# EAGLE design baseboard_rev_0.2 (EAGLE 6.4)
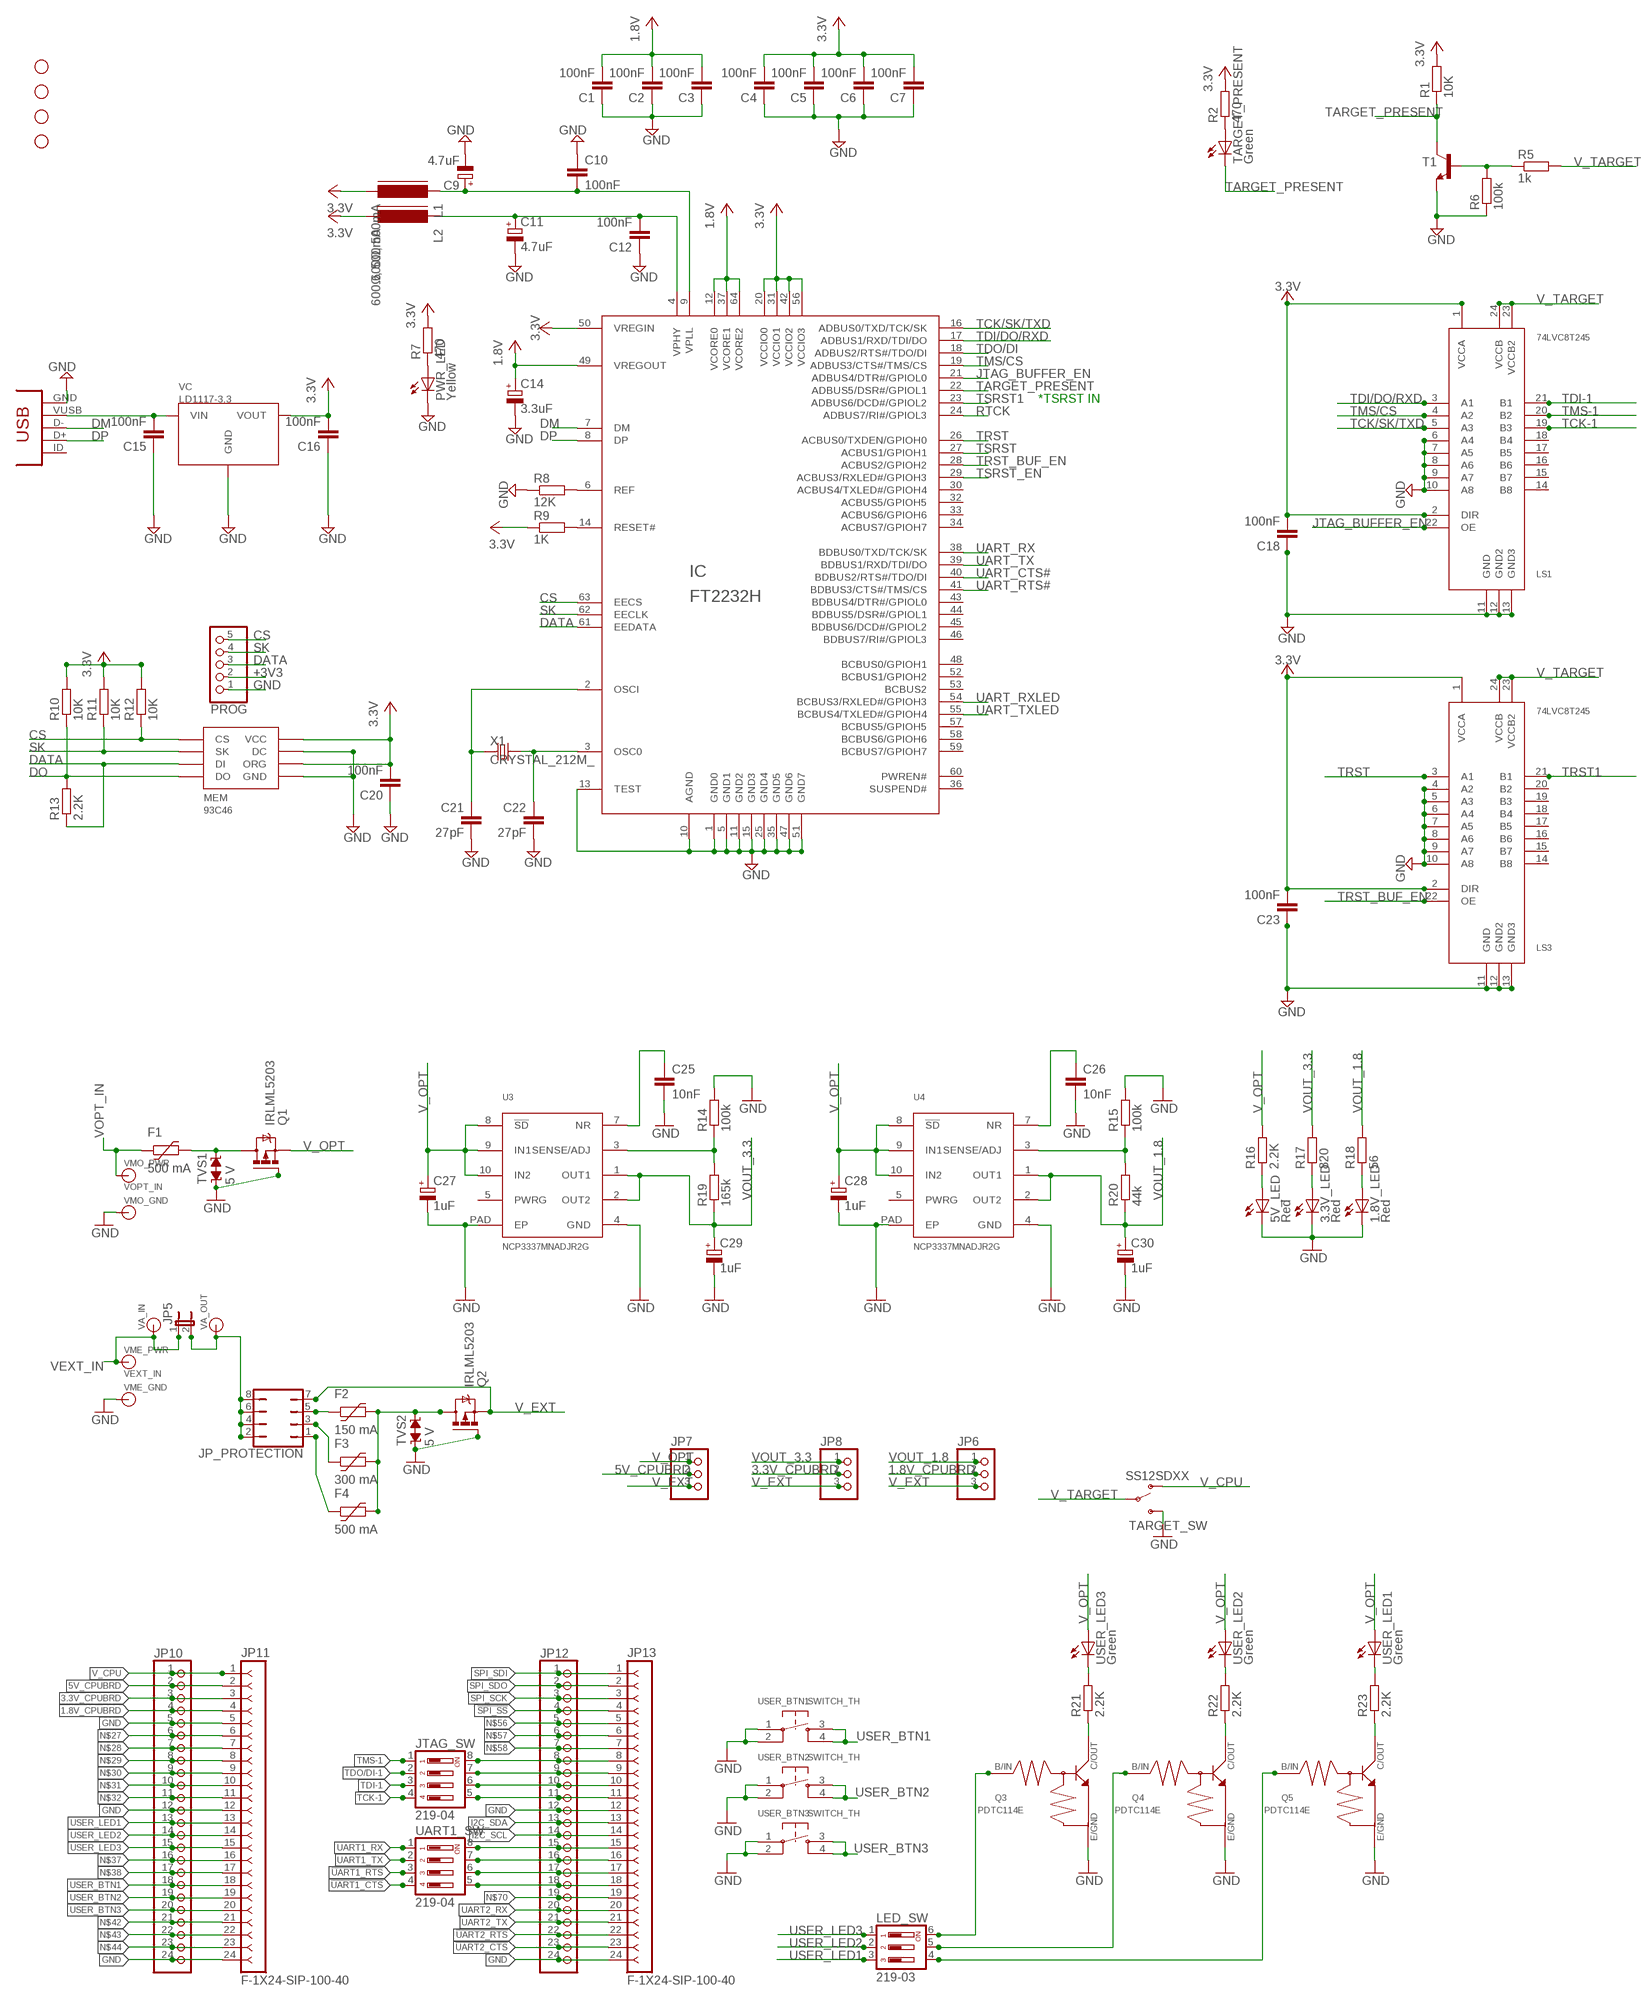
[diagram p0: schematic, sheet 1, part 1 of 2]
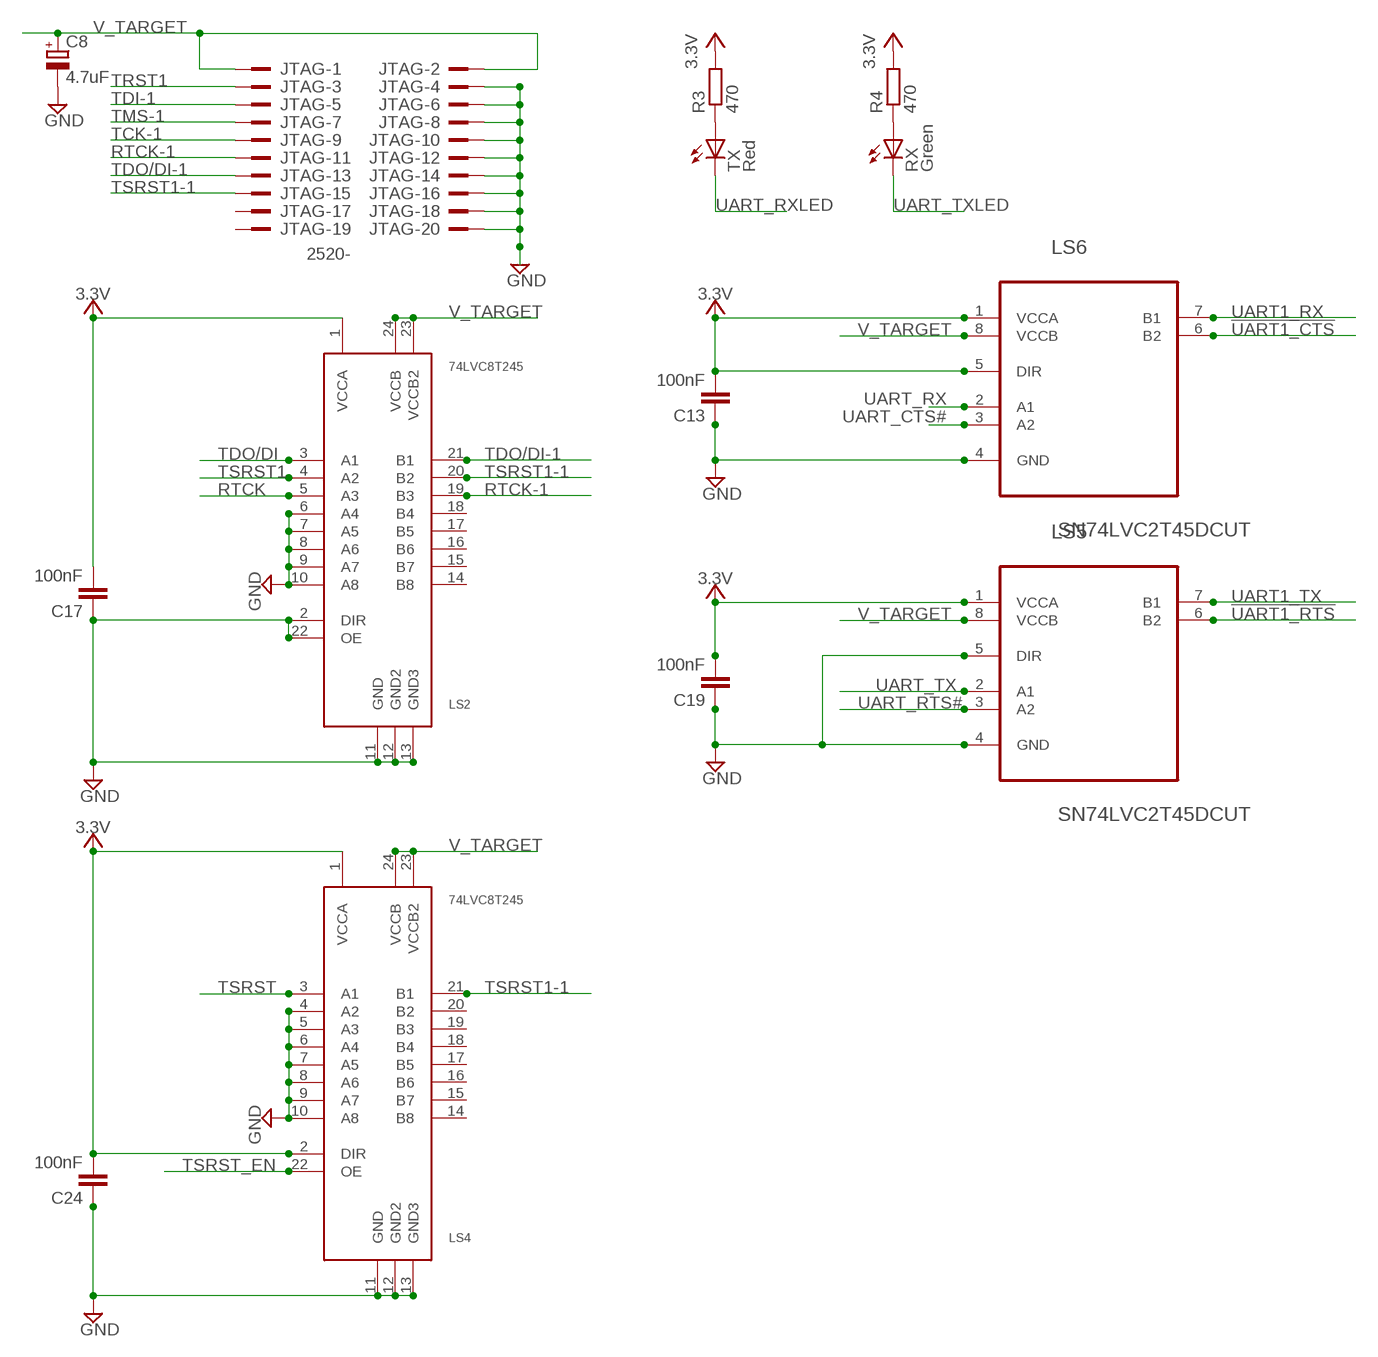
[diagram p1: schematic, sheet 1, part 2 of 2]

## Parts
1.8V_LED  Red  LEDCHIPLED_0805  [CHIPLED_0805]
3.3V_LED  Red  LEDCHIPLED_0805  [CHIPLED_0805]
5V_LED  Red  LEDCHIPLED_0805  [CHIPLED_0805]
C1  100nF  CAPC805  [C805]
C2  100nF  CAPC805  [C805]
C3  100nF  CAPC805  [C805]
C4  100nF  CAPC805  [C805]
C5  100nF  CAPC805  [C805]
C6  100nF  CAPC805  [C805]
C7  100nF  CAPC805  [C805]
C8  4.7uF  CAP_POLSMC_A  [SMC_A]
C9  4.7uF  CAP_POLSMC_A  [SMC_A]
C10  100nF  CAPC805  [C805]
C11  4.7uF  CAP_POLSMC_A  [SMC_A]
C12  100nF  CAPC805  [C805]
C13  100nF  CAPC805  [C805]
C14  3.3uF  CAP_POLSMC_A  [SMC_A]
C15  100nF  CAPC805  [C805]
C16  100nF  CAPC805  [C805]
C17  100nF  CAPC805  [C805]
C18  100nF  CAPC805  [C805]
C19  100nF  CAPC805  [C805]
C20  100nF  CAPC805  [C805]
C21  27pF  CAPC805  [C805]
C22  27pF  CAPC805  [C805]
C23  100nF  CAPC805  [C805]
C24  100nF  CAPC805  [C805]
C25  10nF  C-EUC0805  [C0805]
C26  10nF  C-EUC0805  [C0805]
C27  1uF  CPOL-EUB  [PANASONIC_B]
C28  1uF  CPOL-EUB  [PANASONIC_B]
C29  1uF  CPOL-EUB  [PANASONIC_B]
C30  1uF  CPOL-EUB  [PANASONIC_B]
CONN1  CONN_USB  [CONN_USB_MINI-B]
F1  500 mA  1206L  [1206L]
F2  150 mA  1206L  [1206L]
F3  300 mA  1206L  [1206L]
F4  500 mA  1206L  [1206L]
IC  FT2232H  [LQFP64]
JP1  STAND-OFF  [STAND-OFF]
JP2  STAND-OFF  [STAND-OFF]
JP3  STAND-OFF  [STAND-OFF]
JP4  STAND-OFF  [STAND-OFF]
JP5  JUMPER-2PTH  [1X02]
JP6  PINHD-1X3  [1X03]
JP7  PINHD-1X3  [1X03]
JP8  PINHD-1X3  [1X03]
JP10  PINHD-1X24  [1X24]
JP11  F-1X24-SIP-100-40  [SIP-100-24-40]
JP12  PINHD-1X24  [1X24]
JP13  F-1X24-SIP-100-40  [SIP-100-24-40]
JP_PROTECTION  JP4Q  [JP4Q]
JTAG  2520-  [PAK100/2500-20]
JTAG_SW  219-04  [CTS-219-04]
L1  600Ω, 500mA  FERRITE_BEAD805  [FB805]
L2  600Ω, 500mA  FERRITE_BEAD805  [FB805]
LED_SW  219-03  [CTS-219-03]
LS1  74LVC8T245  [TSSOP24]
LS2  74LVC8T245  [TSSOP24]
LS3  74LVC8T245  [TSSOP24]
LS4  74LVC8T245  [TSSOP24]
LS5  SN74LVC2T45DCUT  [SOP50P310X90-8N]
LS6  SN74LVC2T45DCUT  [SOP50P310X90-8N]
MEM  93C46  [SOIC8]
PROG  PINHD-1X5  [1X05]
PWR_LED  Yellow  LEDCHIPLED_0805  [CHIPLED_0805]
Q1  IRLML5203  [MICRO3]
Q2  IRLML5203  [MICRO3]
Q3  PDTC114E  [SOT416]
Q4  PDTC114E  [SOT416]
Q5  PDTC114E  [SOT416]
R1  10K  RESISTORR805R805  [R805]
R2  470  RESISTORR805R805  [R805]
R3  470  RESISTORR805R805  [R805]
R4  470  RESISTORR805R805  [R805]
R5  1k  RESISTORR805R805  [R805]
R6  100k  RESISTORR805R805  [R805]
R7  470  RESISTORR805R805  [R805]
R8  12K  RESISTORR805R805  [R805]
R9  1K  RESISTORR805R805  [R805]
R10  10K  RESISTORR805R805  [R805]
R11  10K  RESISTORR805R805  [R805]
R12  10K  RESISTORR805R805  [R805]
R13  2.2K  RESISTORR805R805  [R805]
R14  100k  R-EU_R0805  [R0805]
R15  100k  R-EU_R0805  [R0805]
R16  2.2K  R-EU_R0805  [R0805]
R17  820  R-EU_R0805  [R0805]
R18  56  R-EU_R0805  [R0805]
R19  165k  R-EU_R0805  [R0805]
R20  44k  R-EU_R0805  [R0805]
R21  2.2K  R-EU_R0805  [R0805]
R22  2.2K  R-EU_R0805  [R0805]
R23  2.2K  R-EU_R0805  [R0805]
RX  Green  LEDCHIPLED_0805  [CHIPLED_0805]
T1  NPNSOT23BEC  [SOT23-BEC]
TARGET_PRESENT  Green  LEDCHIPLED_0805  [CHIPLED_0805]
TARGET_SW  SS12SDXX  [SS12SDXX]
TVS1  5 V  TVS-0805  [TVS0805]
TVS2  5 V  TVS-0805  [TVS0805]
TX  Red  LEDCHIPLED_0805  [CHIPLED_0805]
U3  NCP3337MNADJR2G  NCP3337  [DFN10]
U4  NCP3337MNADJR2G  NCP3337  [DFN10]
UART1_SW  219-04  [CTS-219-04]
USER_BTN1  SWITCH_TH  [SWITCH_TROUGHHOLE]
USER_BTN2  SWITCH_TH  [SWITCH_TROUGHHOLE]
USER_BTN3  SWITCH_TH  [SWITCH_TROUGHHOLE]
USER_LED1  Green  LEDCHIPLED_0805  [CHIPLED_0805]
USER_LED2  Green  LEDCHIPLED_0805  [CHIPLED_0805]
USER_LED3  Green  LEDCHIPLED_0805  [CHIPLED_0805]
VA_IN  BANANA_CONN  [BANANA_CONN]
VA_OUT  BANANA_CONN  [BANANA_CONN]
VC  LD1117-3.3  [SOT223]
VME_GND  BANANA_CONN  [BANANA_CONN]
VME_PWR  VEXT_IN  BANANA_CONN  [BANANA_CONN]
VMO_GND  BANANA_CONN  [BANANA_CONN]
VMO_PWR  VOPT_IN  BANANA_CONN  [BANANA_CONN]
X1  CRYSTAL_212M_  [4X6]

## Nets
1.8V: C1.2 C2.2 C3.2 C14.+ IC.12(VCORE0) IC.37(VCORE1) IC.49(VREGOUT) IC.64(VCORE2)
1.8V_CPUBRD: JP6.2 JP10.4 JP11.4
3.3V_CPUBRD: JP8.2 JP10.3 JP11.3
5V_CPUBRD: JP7.2 JP10.2 JP11.2
!SPI_SS: JP12.4 JP13.4
!UART1_CTS: LS6.6(B2) UART1_SW.4
!UART1_RTS: LS5.6(B2) UART1_SW.3
!UART2_CTS: JP12.23 JP13.23
!UART2_RTS: JP12.22 JP13.22
+3V3: C4.2 C5.2 C6.2 C7.2 C13.2 C16.2 C17.2 C18.2 C19.2 C20.2 C23.2 C24.2 IC.20(VCCIO0) IC.31(VCCIO1) IC.42(VCCIO2) IC.50(VREGIN) IC.56(VCCIO3) L1.2 L2.2 LS1.1(VCCA) LS1.2(DIR) LS2.1(VCCA) LS3.1(VCCA) LS3.2(DIR) LS4.1(VCCA) LS4.2(DIR) LS5.1(VCCA) LS6.1(VCCA) LS6.5(DIR) MEM.6(ORG) MEM.8(VCC) PROG.2 R1.2 R2.2 R3.2 R4.2 R7.2 R9.1 R10.2 R11.2 R12.2 VC.2(VOUT) ; supply symbol labelled 3.3V
CS: IC.63(EECS) MEM.1(CS) PROG.5 R12.1
DATA: IC.61(EEDATA) MEM.3(DI) PROG.3 R13.1
DM: CONN1.D- IC.7(DM)
DO: MEM.4(DO) R10.1 R13.2
DP: CONN1.D+ IC.8(DP)
GND: 1.8V_LED.C 3.3V_LED.C 5V_LED.C C1.1 C2.1 C3.1 C4.1 C5.1 C6.1 C7.1 C8.- C9.- C10.1 C11.- C12.1 C13.1 C14.- C15.1 C16.1 C17.1 C18.1 C19.1 C20.1 C21.2 C22.2 C23.1 C24.1 C25.2 C26.2 C27.- C28.- C29.- C30.- CONN1.GND IC.1(GND0) IC.5(GND1) IC.10(AGND) IC.11(GND2) IC.13(TEST) IC.15(GND3) IC.25(GND4) IC.35(GND5) IC.47(GND6) IC.51(GND7) JP10.5 JP10.12 JP10.24 JP11.5 JP11.12 JP11.24 JP12.12 JP12.24 JP13.12 JP13.24 JTAG.4 JTAG.6 JTAG.8 JTAG.10 JTAG.12 JTAG.14 JTAG.16 JTAG.18 JTAG.20 LS1.6(A4) LS1.7(A5) LS1.8(A6) LS1.9(A7) LS1.10(A8) LS1.11(GND) LS1.12(GND2) LS1.13(GND3) LS2.2(DIR) LS2.6(A4) LS2.7(A5) LS2.8(A6) LS2.9(A7) LS2.10(A8) LS2.11(GND) LS2.12(GND2) LS2.13(GND3) LS2.22(OE) LS3.4(A2) LS3.5(A3) LS3.6(A4) LS3.7(A5) LS3.8(A6) LS3.9(A7) LS3.10(A8) LS3.11(GND) LS3.12(GND2) LS3.13(GND3) LS4.4(A2) LS4.5(A3) LS4.6(A4) LS4.7(A5) LS4.8(A6) LS4.9(A7) LS4.10(A8) LS4.11(GND) LS4.12(GND2) LS4.13(GND3) LS5.4(GND) LS5.5(DIR) LS6.4(GND) MEM.5(GND) MEM.7(DC) PROG.1 PWR_LED.C Q1.1(G) Q2.1(G) Q3.2(E) Q4.2(E) Q5.2(E) R6.1 R8.1 R14.2 R15.2 T1.E TARGET_SW.3 TVS1.1 TVS2.1 U3.4(GND) U3.PAD(EP) U4.4(GND) U4.PAD(EP) USER_BTN1.1 USER_BTN1.2 USER_BTN2.1 USER_BTN2.2 USER_BTN3.1 USER_BTN3.2 VC.1(GND) VME_GND.P$1 VMO_GND.P$1
I2C_SCL: JP12.14 JP13.14
I2C_SDA: JP12.13 JP13.13
JTAG_BUFFER_EN: IC.21(ADBUS4/DTR#/GPIOL0) LS1.22(OE)
JTAG_TCK: JP12.11 JP13.11 JTAG_SW.5
JTAG_TDI: JP12.10 JP13.10 JTAG_SW.6
JTAG_TDO: JP12.9 JP13.9 JTAG_SW.7
JTAG_TMS: JP12.8 JP13.8 JTAG_SW.8
N$1: LED_SW.6 Q3.1(B)
N$2: C22.1 IC.3(OSC0) X1.2(X2)
N$3: F2.P$1 JP_PROTECTION.5
N$4: F3.P$1 JP_PROTECTION.3
N$5: F4.P$1 JP_PROTECTION.1
N$6: F2.P$2 F3.P$2 F4.P$2 Q2.3(D) TVS2.2
N$7: C21.1 IC.2(OSCI) X1.1(X1)
N$8: C15.2 CONN1.VUSB VC.3(VIN)
N$9: IC.14(RESET#) R9.2
N$10: IC.6(REF) R8.2
N$11: 3.3V_LED.A R17.1
N$12: R5.1 R6.2 T1.B
N$13: PWR_LED.A R7.1
N$14: R2.1 TARGET_PRESENT.A
N$15: F1.P$2 Q1.3(D) TVS1.2
N$16: 5V_LED.A R16.1
N$17: R4.1 RX.A
N$18: R3.1 TX.A
N$20: LED_SW.4 Q5.1(B)
N$24: 1.8V_LED.A R18.1
N$27: JP10.6 JP11.6
N$28: JP10.7 JP11.7
N$29: JP10.8 JP11.8
N$30: JP10.9 JP11.9
N$31: JP10.10 JP11.10
N$32: JP10.11 JP11.11
N$37: JP10.16 JP11.16
N$38: JP10.17 JP11.17
N$42: JP10.21 JP11.21
N$43: JP10.22 JP11.22
N$44: JP10.23 JP11.23
N$51: C25.1 U3.7(NR)
N$56: JP12.5 JP13.5
N$57: JP12.6 JP13.6
N$58: JP12.7 JP13.7
N$59: Q3.3(C) R21.1
N$60: R21.2 USER_LED3.C
N$61: R22.2 USER_LED2.C
N$62: R23.2 USER_LED1.C
N$63: Q4.3(C) R22.1
N$66: JP12.15 JP13.15 UART1_SW.8
N$67: JP12.16 JP13.16 UART1_SW.7
N$68: JP12.17 JP13.17 UART1_SW.6
N$69: JP12.18 JP13.18 UART1_SW.5
N$70: JP12.19 JP13.19
N$73: R14.1 R19.2 U3.3(SENSE/ADJ)
N$74: Q5.3(C) R23.1
N$78: C26.1 U4.7(NR)
N$79: LED_SW.5 Q4.1(B)
N$80: R15.1 R20.2 U4.3(SENSE/ADJ)
RTCK: IC.24(ADBUS7/RI#/GPIOL3) LS2.5(A3)
RTCK-1: JTAG.11 LS2.19(B3)
SK: IC.62(EECLK) MEM.2(SK) PROG.4 R11.1
SPI_SCK: JP12.3 JP13.3
SPI_SDI: JP12.1 JP13.1
SPI_SDO: JP12.2 JP13.2
TARGET_PRESENT: IC.22(ADBUS5/DSR#/GPIOL1) R1.1 T1.C TARGET_PRESENT.C
TCK-1: JTAG.9 JTAG_SW.4 LS1.19(B3)
TCK/SK/TXD: IC.16(ADBUS0/TXD/TCK/SK) LS1.5(A3)
TDI-1: JTAG.5 JTAG_SW.3 LS1.21(B1)
TDI/DO/RXD: IC.17(ADBUS1/RXD/TDI/DO) LS1.3(A1)
TDO/DI: IC.18(ADBUS2/RTS#/TDO/DI) LS2.3(A1)
TDO/DI-1: JTAG.13 JTAG_SW.2 LS2.21(B1)
TMS-1: JTAG.7 JTAG_SW.1 LS1.20(B2)
TMS/CS: IC.19(ADBUS3/CTS#/TMS/CS) LS1.4(A2)
TRST: IC.26(ACBUS0/TXDEN/GPIOH0) LS3.3(A1)
TRST1: JTAG.3 LS3.21(B1)
TRST_BUF_EN: IC.28(ACBUS2/GPIOH2) LS3.22(OE)
TSRST: IC.27(ACBUS1/GPIOH1) LS4.3(A1)
TSRST1: IC.23(ADBUS6/DCD#/GPIOL2) LS2.4(A2)
TSRST1-1: JTAG.15 LS2.20(B2) LS4.21(B1)
TSRST_EN: IC.29(ACBUS3/RXLED#/GPIOH3) LS4.22(OE)
UART1_RX: LS6.7(B1) UART1_SW.1
UART1_TX: LS5.7(B1) UART1_SW.2
UART2_RX: JP12.20 JP13.20
UART2_TX: JP12.21 JP13.21
UART_CTS#: IC.40(BDBUS2/RTS#/TDO/DI) LS6.3(A2)
UART_RTS#: IC.41(BDBUS3/CTS#/TMS/CS) LS5.3(A2)
UART_RX: IC.38(BDBUS0/TXD/TCK/SK) LS6.2(A1)
UART_RXLED: IC.54(BCBUS3/RXLED#/GPIOH3) TX.C
UART_TX: IC.39(BDBUS1/RXD/TDI/DO) LS5.2(A1)
UART_TXLED: IC.55(BCBUS4/TXLED#/GPIOH4) RX.C
USER_BTN1: JP10.18 JP11.18 USER_BTN1.3 USER_BTN1.4
USER_BTN2: JP10.19 JP11.19 USER_BTN2.3 USER_BTN2.4
USER_BTN3: JP10.20 JP11.20 USER_BTN3.3 USER_BTN3.4
USER_LED1: JP10.13 JP11.13 LED_SW.3
USER_LED2: JP10.14 JP11.14 LED_SW.2
USER_LED3: JP10.15 JP11.15 LED_SW.1
V_CPU: JP10.1 JP11.1 TARGET_SW.1
V_EXT: JP6.3 JP7.3 JP8.3 JP_PROTECTION.7 Q2.2(S)
V_OPT: C27.+ C28.+ JP7.1 Q1.2(S) R16.2 U3.8(!SD) U3.9(IN1) U3.10(IN2) U4.8(!SD) U4.9(IN1) U4.10(IN2) USER_LED1.A USER_LED2.A USER_LED3.A
V_TARGET: C8.+ JTAG.1 JTAG.2 LS1.23(VCCB2) LS1.24(VCCB) LS2.23(VCCB2) LS2.24(VCCB) LS3.23(VCCB2) LS3.24(VCCB) LS4.23(VCCB2) LS4.24(VCCB) LS5.8(VCCB) LS6.8(VCCB) R5.2 TARGET_SW.2
VEXT_IN: JP5.1 JP5.2 JP_PROTECTION.2 JP_PROTECTION.4 JP_PROTECTION.6 JP_PROTECTION.8 VA_IN.P$1 VA_OUT.P$1 VME_PWR.P$1
VOPT_IN: F1.P$1 VMO_PWR.P$1
VOUT_1.8: C30.+ JP6.1 R18.2 R20.1 U4.1(OUT1) U4.2(OUT2)
VOUT_3.3: C29.+ JP8.1 R17.2 R19.1 U3.1(OUT1) U3.2(OUT2)
VPHY: C11.+ C12.2 IC.4(VPHY) L2.1
VPLL: C9.+ C10.2 IC.9(VPLL) L1.1
Unconnected: CONN1.BODY@1(BODY) CONN1.BODY@2(BODY) CONN1.BODY@3(BODY) CONN1.BODY@4(BODY) CONN1.ID(USBID) IC.30(ACBUS4/TXLED#/GPIOH4) IC.32(ACBUS5/GPIOH5) IC.33(ACBUS6/GPIOH6) IC.34(ACBUS7/GPIOH7) IC.36(SUSPEND#) IC.43(BDBUS4/DTR#/GPIOL0) IC.44(BDBUS5/DSR#/GPIOL1) IC.45(BDBUS6/DCD#/GPIOL2) IC.46(BDBUS7/RI#/GPIOL3) IC.48(BCBUS0/GPIOH1) IC.52(BCBUS1/GPIOH2) IC.53(BCBUS2) IC.57(BCBUS5/GPIOH5) IC.58(BCBUS6/GPIOH6) IC.59(BCBUS7/GPIOH7) IC.60(PWREN#) JTAG.17 JTAG.19 LS1.14(B8) LS1.15(B7) LS1.16(B6) LS1.17(B5) LS1.18(B4) LS2.14(B8) LS2.15(B7) LS2.16(B6) LS2.17(B5) LS2.18(B4) LS3.14(B8) LS3.15(B7) LS3.16(B6) LS3.17(B5) LS3.18(B4) LS3.19(B3) LS3.20(B2) LS4.14(B8) LS4.15(B7) LS4.16(B6) LS4.17(B5) LS4.18(B4) LS4.19(B3) LS4.20(B2) U3.5(PWRG) U4.5(PWRG)

## Notes on the sheet
- *TSRST IN

## Library data of the parts
1.8V_LED 3.3V_LED 5V_LED USER_LED1-USER_LED3 = adafruit:LED: LED
C1-C7 C10 C12 C13 C15-C24 = DP-EagleLibrary:CAP
C8 C9 C11 C14 = DP-EagleLibrary:CAP_POL
C25 C26 = rcl:C-EU: CAPACITOR, European symbol
C27-C30 = rcl:CPOL-EU: POLARIZED CAPACITOR, European symbol
CONN1 = dp_devices:CONN_USB: USB connector
F1-F4 = ptc-littlefuse:1206L
IC = DP-EagleLibrary:FT2232H: DUAL HIGH SPEED USB TO MULTIPURPOSE UART/FIFO IC
JP1-JP4 = SparkFun-Electromechanical:STAND-OFF: #4 Stand Off This is the mechanical footprint for a #4 phillips button head screw. Use the keepout ring to avoid running the screw head into surrounding components. SKU : PRT-00447
JP5 = SparkFun-Passives:JUMPER-2: Jumper Basic 0.1" spaced jumper. Use with breakaway headers.
JP6-JP8 = pinhead:PINHD-1X3: PIN HEADER
JP10 JP12 = pinhead:PINHD-1X24: PIN HEADER
JP11 JP13 = con-headers-jp:F-1X24-: FEMALE HEADER
JP_PROTECTION = jumper:JP4Q: JUMPER
JTAG = con-3m:2520-: 3M (TM) Pak 100 4-Wall Header Source: 3M
JTAG_SW UART1_SW = switch-dil:219-04*: Surface Mount DIP Switch Series 219 SMT CTS Electronic Components Sourc: www.ctscorp.com; OC_FARNELL: unknown; OC_NEWARK: unknown
L1 L2 = DP-EagleLibrary:FERRITE_BEAD
LED_SW = switch-dil:219-03*: Surface Mount DIP Switch Series 219 SMT CTS Electronic Components Sourc: www.ctscorp.com; OC_FARNELL: unknown; OC_NEWARK: unknown
LS1-LS4 = 74lvc8t245:74LVC8T245
LS5 LS6 = 74lvc2t45:SN74LVC2T45DCUT: DUAL-BIT DUAL-SUPPLY BUS TRANSCEIVER WITH CONFIGURABLE VOLTAGE TRANSLATION AND 3-STATE OUTPUTS; MPN: SN74LVC2T45DCUT; OC_FARNELL: 9592768; OC_NEWARK: 01J0800; PACKAGE: SOP-8; SUPPLIER: Texas Instruments
MEM = DP-EagleLibrary:93C46
PROG = pinhead:PINHD-1X5: PIN HEADER
PWR_LED RX TARGET_PRESENT TX = led:LED: LED
Q1 Q2 = transistor-power:IRLML5203: HEXFET P-Channel Power MOSFET
Q3-Q5 = funkfinger:PDTC114E: NXP PDTC114E series http://www.nxp.com/documents/data_sheet/PDTC114E_SER.pdf
R1-R13 = DP-EagleLibrary:RESISTOR
R14-R23 = rcl:R-EU_: RESISTOR, European symbol
T1 = dp_devices:NPN: Most commonly used is SOT23-BEC
TARGET_SW = devboard:SS12SDXX
TVS1 TVS2 = supressor:TVS-: TVS BI-DIRECTIONAL
U3 U4 = devboard:NCP3337
USER_BTN1-USER_BTN3 = funkfinger:SWITCH_TH
VA_IN VA_OUT VME_GND VME_PWR VMO_GND VMO_PWR = SparkFun-Connectors:BANANA_CONN: Through-hole banana jack
VC = DP-EagleLibrary:LD1117-3.3
X1 = dp_devices:CRYSTAL_2

## Board
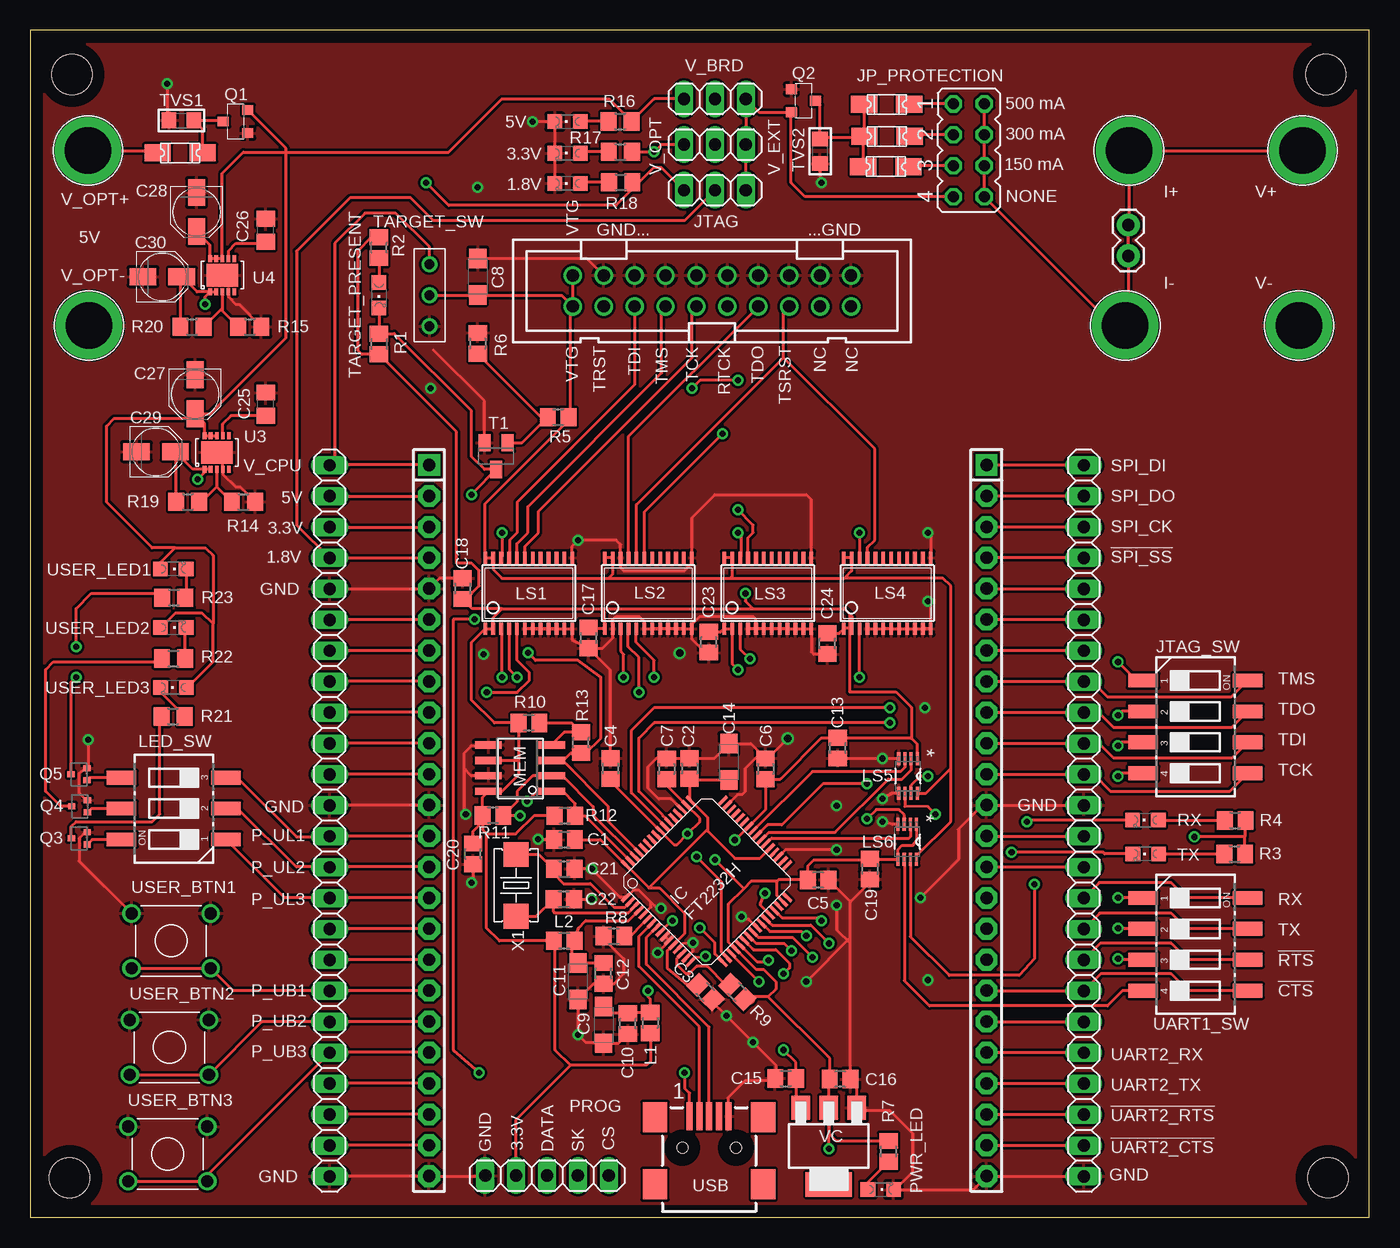
[diagram p2: board, top side]
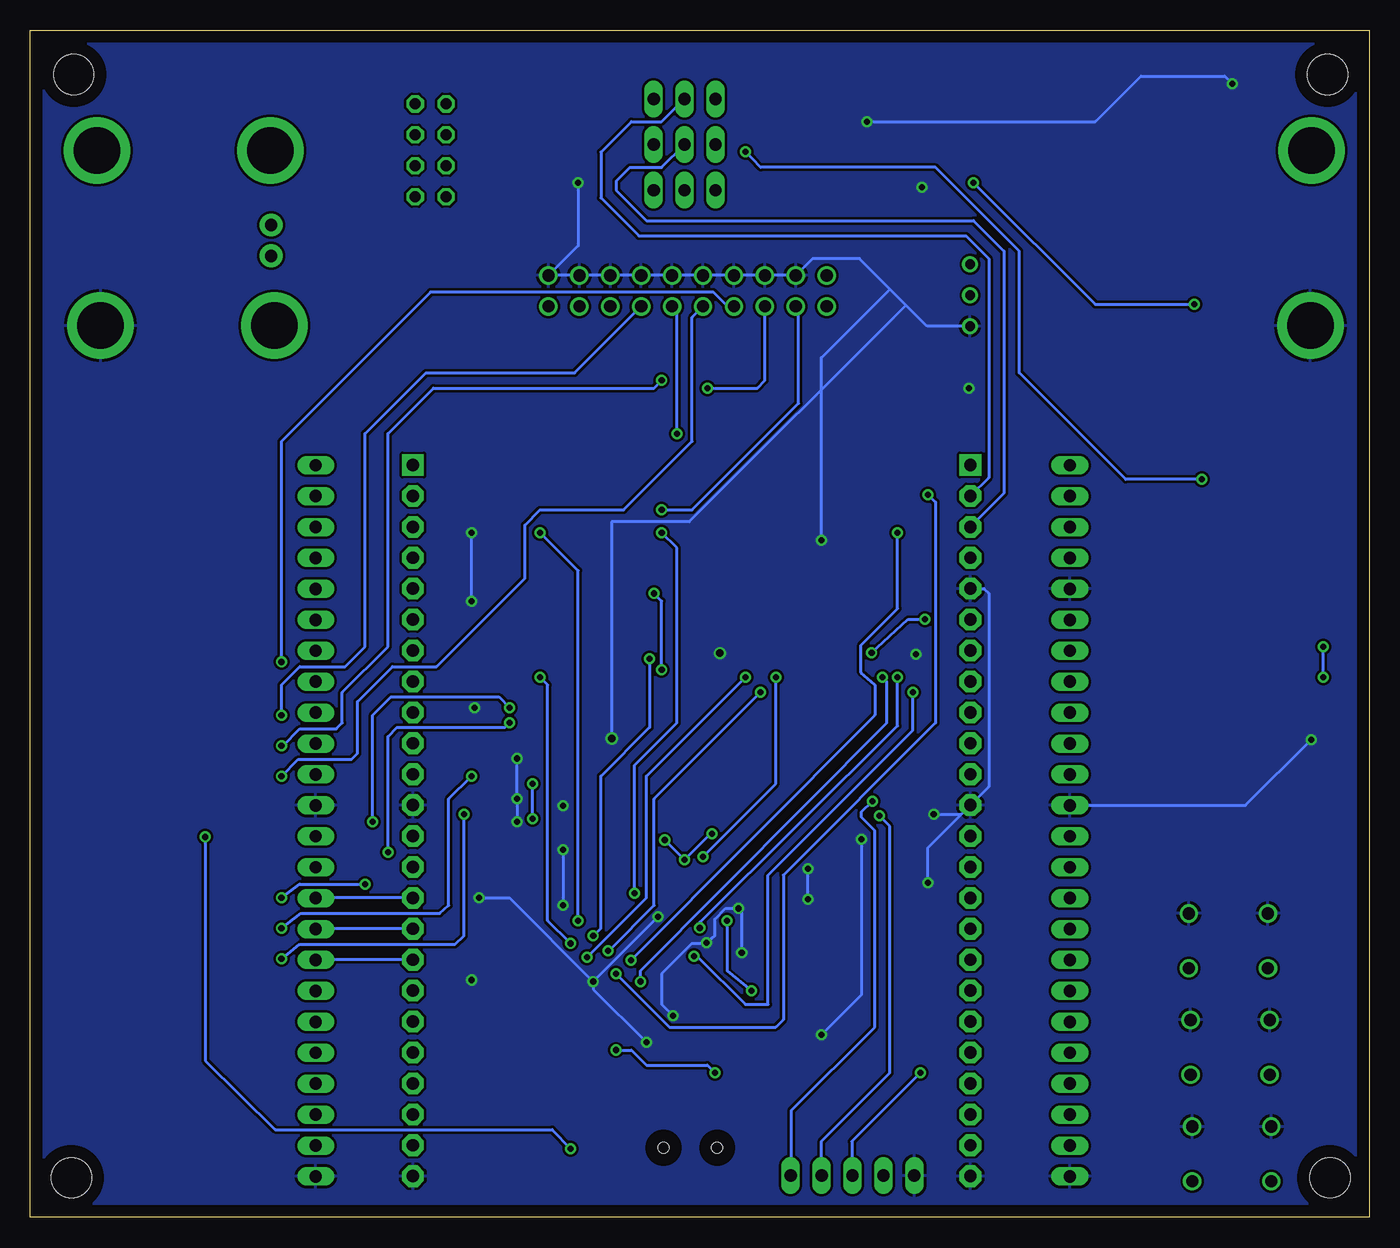
[diagram p3: board, bottom side, seen from below]

Size 110 x 97.5 mm. Coordinates in mm from the lower left corner, seen from the top.
Outline: 0,0 110,0 110,97.5 0,97.5 0,0
Copper layers (1*16): Top 0.035mm / dielectric 1.5mm / Bottom 0.035mm
Design rules "default": minimum track width 10mil, minimum drill 24mil, track to track 8mil, track to pad 8mil, pad to pad 8mil, via to via 8mil, smd to smd 8mil, copper to edge 40mil, drill to drill 8mil, minimum pad ring 10mil, minimum via ring 8mil, stop-mask expansion 4mil, vias tented up to drill 0mil, thermal gap 10mil

### Footprints (pad centres in the part's own frame; a part is rotated, then mirrored left to right if it is on the bottom)
CHIPLED_0805 = smd 1.2 x 1.2: A 0,-1.05; C 0,1.05
C805 = smd 1.3 x 1.5: 1 -0.85,0; 2 0.85,0
SMC_A = smd 1.6 x 1.4: + -1.5,0; - 1.5,0
C0805 = smd 1.3 x 1.5: 1 -0.95,0; 2 0.95,0
PANASONIC_B = smd 2.2 x 1.4: + 1.6,0; - -1.6,0
CONN_USB_MINI-B = smd 2 x 2.5: BODY@1 -4.45,2.5; BODY@2 4.45,2.5; BODY@3 4.45,-3; BODY@4 -4.45,-3 | smd 0.5 x 2.3: D+ 0,2.6; D- -0.8,2.6; GND 1.6,2.6; ID 0.8,2.6; VUSB -1.6,2.6 | hole 0.9: -2.2,0; 2.2,0
1206L = smd 2.16 x 1.4: P$1 -1.85,0; P$2 1.85,0
LQFP64 = smd 1 x 0.27: 1 -5.6,3.75; 2 -5.6,3.25; 3 -5.6,2.75; 4 -5.6,2.25; 5 -5.6,1.75; 6 -5.6,1.25; 7 -5.6,0.75; 8 -5.6,0.25; 9 -5.6,-0.25; 10 -5.6,-0.75; 11 -5.6,-1.25; 12 -5.6,-1.75; 13 -5.6,-2.25; 14 -5.6,-2.75; 15 -5.6,-3.25; 16 -5.6,-3.75; 33 5.6,-3.75; 34 5.6,-3.25; 35 5.6,-2.75; 36 5.6,-2.25; 37 5.6,-1.75; 38 5.6,-1.25; 39 5.6,-0.75; 40 5.6,-0.25; 41 5.6,0.25; 42 5.6,0.75; 43 5.6,1.25; 44 5.6,1.75; 45 5.6,2.25; 46 5.6,2.75; 47 5.6,3.25; 48 5.6,3.75 | smd 0.27 x 1: 17 -3.75,-5.6; 18 -3.25,-5.6; 19 -2.75,-5.6; 20 -2.25,-5.6; 21 -1.75,-5.6; 22 -1.25,-5.6; 23 -0.75,-5.6; 24 -0.25,-5.6; 25 0.25,-5.6; 26 0.75,-5.6; 27 1.25,-5.6; 28 1.75,-5.6; 29 2.25,-5.6; 30 2.75,-5.6; 31 3.25,-5.6; 32 3.75,-5.6; 49 3.75,5.6; 50 3.25,5.6; 51 2.75,5.6; 52 2.25,5.6; 53 1.75,5.6; 54 1.25,5.6; 55 0.75,5.6; 56 0.25,5.6; 57 -0.25,5.6; 58 -0.75,5.6; 59 -1.25,5.6; 60 -1.75,5.6; 61 -2.25,5.6; 62 -2.75,5.6; 63 -3.25,5.6; 64 -3.75,5.6
STAND-OFF = hole 3.302: 0,0
1X02 = drill 1.016 pad 1.88: 1 0,0; 2 2.54,0
1X03 = drill 1.016 long: 1 -2.54,0; 2 0,0; 3 2.54,0
1X24 = drill 1.016 long: 1 -29.21,0; 2 -26.67,0; 3 -24.13,0; 4 -21.59,0; 5 -19.05,0; 6 -16.51,0; 7 -13.97,0; 8 -11.43,0; 9 -8.89,0; 10 -6.35,0; 11 -3.81,0; 12 -1.27,0; 13 1.27,0; 14 3.81,0; 15 6.35,0; 16 8.89,0; 17 11.43,0; 18 13.97,0; 19 16.51,0; 20 19.05,0; 21 21.59,0; 22 24.13,0; 23 26.67,0; 24 29.21,0
SIP-100-24-40 = drill 1.016 pad 1.778 square: 1 -29.21,0 | drill 1.016 pad 1.778 octagon: 2 -26.67,0; 3 -24.13,0; 4 -21.59,0; 5 -19.05,0; 6 -16.51,0; 7 -13.97,0; 8 -11.43,0; 9 -8.89,0; 10 -6.35,0; 11 -3.81,0; 12 -1.27,0; 13 1.27,0; 14 3.81,0; 15 6.35,0; 16 8.89,0; 17 11.43,0; 18 13.97,0; 19 16.51,0; 20 19.05,0; 21 21.59,0; 22 24.13,0; 23 26.67,0; 24 29.21,0
JP4Q = drill 0.914 octagon: 1 -3.81,-1.27; 2 -3.81,1.27; 3 -1.27,-1.27; 4 -1.27,1.27; 5 1.27,-1.27; 6 1.27,1.27; 7 3.81,-1.27; 8 3.81,1.27
PAK100/2500-20 = drill 1 pad 1.422: 1 -11.43,-1.27; 2 -11.43,1.27; 3 -8.89,-1.27; 4 -8.89,1.27; 5 -6.35,-1.27; 6 -6.35,1.27; 7 -3.81,-1.27; 8 -3.81,1.27; 9 -1.27,-1.27; 10 -1.27,1.27; 11 1.27,-1.27; 12 1.27,1.27; 13 3.81,-1.27; 14 3.81,1.27; 15 6.35,-1.27; 16 6.35,1.27; 17 8.89,-1.27; 18 8.89,1.27; 19 11.43,-1.27; 20 11.43,1.27
CTS-219-04 = smd 1.13 x 2.44: 1 -3.81,-4.3; 2 -1.27,-4.3; 3 1.27,-4.3; 4 3.81,-4.3; 5 3.81,4.3; 6 1.27,4.3; 7 -1.27,4.3; 8 -3.81,4.3
FB805 = smd 1.3 x 1.5: 1 -0.85,0; 2 0.85,0
CTS-219-03 = smd 1.13 x 2.44: 1 -2.54,-4.3; 2 0,-4.3; 3 2.54,-4.3; 4 2.54,4.3; 5 0,4.3; 6 -2.54,4.3
TSSOP24 = smd 0.305 x 0.991: 1 -3.575,-2.918; 2 -2.925,-2.918; 3 -2.275,-2.918; 4 -1.625,-2.918; 5 -0.975,-2.918; 6 -0.325,-2.918; 7 0.325,-2.918; 8 0.975,-2.918; 9 1.625,-2.918; 10 2.275,-2.918; 11 2.925,-2.918; 12 3.575,-2.918; 13 3.575,2.918; 14 2.925,2.918; 15 2.275,2.918; 16 1.625,2.918; 17 0.975,2.918; 18 0.325,2.918; 19 -0.325,2.918; 20 -0.975,2.918; 21 -1.625,2.918; 22 -2.275,2.918; 23 -2.925,2.918; 24 -3.575,2.918
SOP50P310X90-8N = smd 1.067 x 0.254: 1 -1.422,0.762; 2 -1.422,0.254; 3 -1.422,-0.254; 4 -1.422,-0.762; 5 1.422,-0.762; 6 1.422,-0.254; 7 1.422,0.254; 8 1.422,0.762
SOIC8 = smd 0.6 x 2.2: 1 -1.905,-2.6; 2 -0.635,-2.6; 3 0.635,-2.6; 4 1.905,-2.6; 5 1.905,2.6; 6 0.635,2.6; 7 -0.635,2.6; 8 -1.905,2.6
1X05 = drill 1.016 long: 1 -5.08,0; 2 -2.54,0; 3 0,0; 4 2.54,0; 5 5.08,0
MICRO3 = smd 0.8 x 0.9: 1 -0.95,-1; 2 0.95,-1; 3 0,1
SOT416 = smd 0.6 x 0.5: 1 0.66,-0.51; 2 0.66,0.49; 3 -0.64,-0.01
R805 = smd 1.3 x 1.5: 1 -0.85,0; 2 0.85,0
R0805 = smd 1.3 x 1.5: 1 -0.95,0; 2 0.95,0
SOT23-BEC = smd 1 x 1.4: B -0.95,-1.1; C 0,1.1; E 0.95,-1.1
SS12SDXX = drill 0.8: 1 0,2.54; 2 0,0; 3 0,-2.54
TVS0805 = smd 1.2 x 1.3: 1 -1.016,0; 2 1.016,0
DFN10 = smd 0.301 x 0.565: 1 -1,-1.25; 2 -0.5,-1.25; 3 0,-1.25; 4 0.5,-1.25; 5 1,-1.25; 6 1,1.49; 7 0.5,1.49; 8 0,1.49; 9 -0.5,1.49; 10 -1,1.49 | smd 2.602 x 1.851: PAD 0,0.12
SWITCH_TROUGHHOLE = drill 1: 1 -3.25,2.25; 2 3.25,2.25; 3 -3.25,-2.25; 4 3.25,-2.25
BANANA_CONN = drill 3.81 pad 5.461: P$1 0,0
SOT223 = smd 1.5 x 2: 1 -2.3,-3.15; 2 0,-3.15; 3 2.3,-3.15 | smd 3.8 x 2: 4 0,3.15
4X6 = smd 2.032 x 2.032: 1 -2.54,0; 2 2.54,0

### Placement (x,y rotation side)
1.8V_LED  44.14,84.94 90 top
3.3V_LED  44.14,87.42 90 top
5V_LED  44.14,90.02 90 top
C1  43.88,31.04 0 top
C2  54.16,36.87 270 top
C3  55.47,18.51 135 top
C4  47.66,36.86 270 top
C5  64.73,27.71 180 top
C6  60.41,36.85 270 top
C7  52.28,36.84 270 top
C8  36.77,77.28 90 top
C9  47.11,15.8 270 top
C10  49.09,15.91 90 top
C11  44.98,19.39 270 top
C12  47.09,20.04 90 top
C13  66.34,38.55 90 top
C14  57.39,37.41 90 top
C15  62.05,11.41 0 top
C16  66.53,11.37 180 top
C17  45.87,47.6 90 top
C18  35.51,51.65 270 top
C19  68.99,28.61 90 top
C20  36.37,29.86 90 top
C21  43.85,28.64 0 top
C22  43.83,26.14 0 top
C23  55.74,47.24 90 top
C24  65.49,47.12 90 top
C25  19.34,66.81 90 top
C26  19.34,81.08 90 top
C27  13.52,67.61 270 top
C28  13.64,82.58 270 top
C29  10.31,62.9 0 top
C30  10.84,77.27 0 top
CONN1  55.77,5.72 0 top
F1  12.31,87.44 0 top
F2  70.29,86.31 180 top
F3  70.39,88.81 180 top
F4  70.36,91.43 180 top
IC  55.57,27.6 45 top
JP1  106.64,3.25 0 top
JP2  3.42,93.88 0 top
JP3  106.44,93.88 0 top
JP4  3.21,3.25 0 top
JP5  90.22,81.52 270 top
JP6  56.25,84.38 0 top
JP7  56.25,91.88 0 top
JP8  56.25,88.12 0 top
JP10  24.59,32.58 270 top
JP11  32.76,32.59 270 top
JP12  86.56,32.58 270 top
JP13  78.56,32.59 270 top
JP_PROTECTION  77.11,87.66 270 top
JTAG  56,76.11 0 top
JTAG_SW  95.72,40.3 270 top
L1  50.94,15.97 270 top
L2  43.85,22.71 180 top
LED_SW  11.78,33.58 90 top
LS1  40.95,51.28 0 top
LS2  50.77,51.28 0 top
LS3  60.59,51.28 0 top
LS4  70.41,51.28 0 top
LS5  72.11,36.24 270 top
LS6  72.06,30.86 270 top
MEM  40.23,36.91 90 top
PROG  42.45,3.44 0 top
PWR_LED  69.87,2.29 270 top
Q1  16.86,90.02 90 top
Q2  63.52,91.72 270 top
Q3  4,31.14 0 top
Q4  4.04,33.78 0 top
Q5  3.98,36.41 0 top
R1  28.64,71.75 270 top
R2  28.64,79.66 90 top
R3  98.95,29.86 0 top
R4  99,32.61 0 top
R5  43.36,65.73 0 top
R6  36.76,71.8 270 top
R7  70.52,5.42 90 top
R8  47.95,23.11 0 top
R9  58.08,18.52 135 top
R10  40.96,40.62 180 top
R11  38.01,33.02 180 top
R12  43.91,32.99 180 top
R13  45.24,38.99 90 top
R14  17.5,58.78 0 top
R15  18.03,73.16 0 top
R16  48.45,90.03 0 top
R17  48.48,87.53 0 top
R18  48.51,85.03 0 top
R19  12.93,58.78 0 top
R20  13.28,73.16 0 top
R21  11.73,41.16 0 top
R22  11.76,45.91 0 top
R23  11.78,50.91 0 top
RX  91.63,32.64 90 top
T1  38.26,62.53 180 top
TARGET_PRESENT  28.64,75.75 180 top
TARGET_SW  32.78,75.75 0 top
TVS1  12.41,90.11 0 top
TVS2  64.89,87.58 90 top
TX  91.64,29.86 90 top
U3  15.31,62.72 0 top
U4  15.77,77.27 0 top
UART1_SW  95.72,22.43 270 top
USER_BTN1  11.56,22.71 0 top
USER_BTN2  11.42,13.96 0 top
USER_BTN3  11.28,5.21 0 top
USER_LED1  11.74,53.27 270 top
USER_LED2  11.74,48.44 270 top
USER_LED3  11.76,43.53 90 top
VA_IN  90.27,87.63 0 top
VA_OUT  104.54,87.63 0 top
VC  65.6,5.86 180 top
VME_GND  4.82,73.25 0 top
VME_PWR  89.97,73.25 0 top
VMO_GND  104.24,73.25 0 top
VMO_PWR  4.74,87.63 0 top
X1  39.91,27.27 270 top

### Tracks (layer width: path | path; a pad name or v marks a point on that pad's centre or on a via)
1.8V
  Top 0.254: 50.81,27.06 IC.64 46.83,31.04 C1.2 | 55.62,31.88 55.62,32.88 54.29,34.21 IC.49 54.15,34.33 C2.2 54.27,35.91 C14.+ | 55.62,31.88 50.81,27.06 | 55.62,31.88 55.62,31.75 57.88,29.5 59.95,29.5 IC.37 | C3.2 54.01,19.11 52.35,20.48 52.35,21.91 IC.12 53.75,23.3 53.75,25 51.69,27.06 50.81,27.06
1.8V_CPUBRD
  Top 0.254: JP11.4 32.74,54.16 JP10.4 21.88,56.88 21.88,79.38 26.25,83.75 31.25,83.75 33.12,81.88 53.75,81.88 JP6.2
3.3V_CPUBRD
  Top 0.254: JP10.3 32.74,56.7 JP11.3
  Bottom 0.254: JP11.3 30,59.48 30,79.38 32.5,81.88 59.38,81.88 61.88,84.38 61.88,85.12 60.75,86.25 58.12,86.25 JP8.2
5V_CPUBRD
  Top 0.254: JP10.2 32.74,59.24 JP11.2
  Bottom 0.254: JP11.2 31.25,60.77 31.25,78.75 33.12,80.62 60,80.62 63.12,83.75 63.12,87.5 60.62,90 58.12,90 JP7.2
!SPI_SS
  Top 0.254: JP12.4 78.58,54.16 JP13.4
!UART1_CTS
  Top 0.254: UART1_SW.4 89.75,18.62 88.5,17.38 73.88,17.38 71.8,19.45 LS6.6
!UART1_RTS  (via drill 0.5)
  Top 0.254: UART1_SW.3 89.47,21.16 v89.38,21.25 | v74.38,33.12 73.75,33.75 71.86,33.77 LS5.6
  Bottom 0.254: v89.38,21.25 88.88,21.62 87.88,22.43 75.12,22.43 74.38,23.12 v74.38,33.12
!UART2_CTS
  Top 0.254: JP13.23 86.54,5.92 JP12.23
!UART2_RTS
  Top 0.254: JP13.22 86.54,8.46 JP12.22
+3V3  (via drill 0.5)
  Top 0.254: IC.31 61.81,25.94 61.81,25.96 61.35,26.43 61.35,27.6 | IC.56 51.79,31.71 | 51.79,31.71 52.88,30.62 53.12,30.62 v54,31.5 55,32.5 55,32.77 IC.50 52.28,35.48 C7.2 | 58.62,27 v56.25,29.38 | v57.88,31 57.91,31 IC.42 60.41,33.5 C6.2 61.62,36 64.97,39.35 66.04,39.35 C13.2 72.34,39.4 72.39,39.35 | 40.11,37.5 R10.2 38.13,40.62 36.25,42.5 36.25,47.24 LS1.1 LS1.2 38.02,49.27 38.75,50 | 40.11,37.5 40.11,36.36 38.75,35 MEM.8 37.16,34.53 R11.2 37.16,32.5 | MEM.6 40.07,37.54 40.11,37.5 | R12.2 41.37,32.99 39.88,31.5 37.5,31.5 | 37.16,32.5 37.16,31.84 37.5,31.5 | 60.62,18.12 61.25,18.75 61.25,19.38 60.25,20.38 59.62,20.38 57.95,22.05 IC.20 57.91,22.06 57.38,22.6 57.38,25.75 58.62,27 | 60.62,18.12 58.89,18.12 R9.1 | 38.75,50 46.88,50 | 46.88,50 59.38,50 | 59.38,50 66.88,50 67.34,49.54 | 67.5,48.38 67.5,49.38 67.34,49.54 | 67.5,48.38 LS4.2 | 67.5,48.12 67.5,48.38 | 67.5,48.38 | 67.5,48.38 66.84,48.38 LS4.1 66.44,47.98 C24.2 | 46.88,50 47.2,49.68 LS2.1 45.95,48.37 C17.2 | R2.2 28.01,80.51 26.88,79.38 26.88,71.25 27.23,70.89 R1.2 35,64.53 35,53.75 36.25,53.75 36.88,53.12 36.88,51.88 35.8,50.8 C18.2 36.3,50 38.75,50 | VC.2 65.6,11.29 C16.2 65.68,13.07 60.62,18.12 | VC.2 65.6,6.9 66.23,6.27 R7.2 | C4.2 47.66,35.84 51.79,31.71 | 37.5,31.5 37.5,23.75 38.53,22.71 L2.2 43.12,22.56 43.12,13.75 44.38,12.5 | LS6.1 72.82,30.94 72.53,30.55 71.62,30.55 71.29,30.22 LS6.5 71.23,29.38 69.08,29.38 | 69.08,29.38 64.38,29.38 63.88,28.88 C5.2 61.47,27.71 61.35,27.6 | L1.2 50.94,12.81 50.62,12.5 44.38,12.5 | PROG.2 39.91,8.04 44.38,12.5 | C23.2 56.74,48.09 LS3.1 LS3.2 57.66,45.46 v58.12,45 | 69.08,29.38 C19.2
  Top 0.254: C20.2 36.37,31.7 37.16,32.5 | 99.97,30.03 R3.2 99.81,31.3 | R4.2 99.81,32.56 99.81,31.3 | 99.81,31.3 99.75,31.25 v95.62,31.25 | v65.62,5.62 65.62,8.98 VC.2 | v58.75,51.25 58.75,50.62 59.38,50 | 72.39,39.35 72.39,41.89 71.12,43.16 67.31,43.16 67.31,49.51 67.34,49.54 | LS5.1 72.87,38.87 72.39,39.35 | 61.35,27.6 59.23,27.6 58.62,27
  Top 0.813: R9.1 59.13,17.91
  Bottom 0.254: v57.88,31 v56.25,29.38 54.12,31.5 v54,31.5 | v95.62,31.25 95.62,12.88 89.88,7.2 67.12,7.2 v65.62,5.62 | v58.12,45 58.12,50.62 v58.75,51.25
CS  (via drill 0.5)
  Top 0.254: IC.63 45.58,32.99 R12.1 44.77,33.98 43.75,35 MEM.1 41.62,35 v40.83,34.2
  Bottom 0.254: PROG.5 47.5,3.46 47.5,8.75 40.62,15.62 40.62,31.77 41.7,32.85 41.7,33.33 v40.83,34.2
DATA  (via drill 0.5)
  Top 0.254: IC.61 50.02,29.98 47.5,32.5 47.5,33.75 43.75,37.5 | 43.75,37.5 42.87,37.5 MEM.3 43.79,37.54 | R13.1 44.4,38.15 44.38,38.12 | 43.79,37.54 43.75,37.5 | 43.79,37.54 44.38,38.12 | 44.38,38.12 45.62,38.12 46.88,39.38 46.88,44.38 45,45.75 41.5,45.75 v40.88,46.38 | v36.5,49.12 34.75,49.12 34.75,13.75 v36.88,11.88 | 42.5,3.48 PROG.3
  Bottom 0.254: v40.88,46.38 37.88,49.12 v36.5,49.12 | v36.88,11.88 42.5,6.25 42.5,3.48 PROG.3
DM
  Top 0.254: CONN1.D- 54.97,15.65 50,20.62 50,23.09 IC.7
DO
  Top 0.254: MEM.4 43.87,39.84 R13.2 44.47,40.62 R10.1
DP
  Top 0.254: CONN1.D+ 55.77,15.63 50.62,20.77 50.62,23.01 IC.8 51.43,23.81 51.12,23.5
GND  (via drill 0.5, 0.61)
  Top 0.254: C22.2 v46.12,26.14 v46.12,26.12 | C21.2 44.63,28.62 v46.12,28.62 48.46,26.29 IC.1 49.54,26.88 50,26.88 51,25.88 | IC.10 | IC.10 IC.11 52.51,22.76 v51.55,21.73 | LS1.11 LS1.10 LS1.8 LS1.7 | LS1.11 LS1.12 44.52,47.47 C17.1 | LS3.5 LS3.6 LS3.7 LS3.8 LS3.9 LS3.10 LS3.11 LS3.12 64.17,46.46 64.38,46.25 | LS3.5 LS3.4 | LS4.12 LS4.11 | LS2.7 LS2.6 50.45,48.93 50,49.38 48.12,49.38 47.84,49.09 LS2.2 47.88,48.34 47.88,47.62 47,46.75 C17.1 | LS2.7 LS2.8 LS2.9 LS2.10 LS2.11 | LS2.11 LS2.12 | JP11.12 24.61,33.87 JP10.12 | JP10.24 24.61,3.38 JP11.24 37.32,3.38 PROG.1 | JP12.24 86.54,3.38 JP13.24 77.47,2.29 PWR_LED.C 71.04,2.29 72.5,3.75 72.5,6.88 70.62,8.75 68.16,8.75 VC.1 67.9,10.85 C16.1 67.38,23 | JP12.12 86.54,33.87 JP13.12 78.24,33.87 76.25,31.88 76.25,29.38 v73.12,26.25 | C10.1 48.34,14.3 C9.- 47.04,14.38 45.62,14.38 v45,15 44.98,15.02 C11.- 46.29,19.19 C12.1 47.94,19.19 48.75,20 48.75,21.25 47.1,22.9 R8.1 | CONN1.GND 57.37,9.87 58.75,11.25 61.04,11.25 C15.1 61.25,11.46 61.25,12.5 v59.38,14.38 v57.19,16.56 56.07,17.68 C3.1 | IC.5 51,25.5 51,25.88 | v51.83,25.38 51.5,25.38 51,25.88 | IC.13 53.2,22.08 53.62,22.5 v54.45,22.57 54.45,21.88 IC.15 | 67.38,23 67.38,25.91 | 67.38,25.91 C5.1 | v66.25,25.62 66.25,23.63 67.38,22.5 | 67.38,23 v63.75,19.38 | C1.1 42.09,31.04 v41.7,31.05 | MEM.7 36.23,36.27 35.62,36.88 | 35.62,36.88 35.62,38.12 36.25,38.75 37.57,38.75 MEM.5 | C18.1 33.61,52.49 JP11.5 32.74,51.62 JP10.5 | LS2.12 54.38,48.34 54.38,47.5 55.48,46.4 C23.1 55.88,46.97 | C19.1 68.99,27.52 67.38,25.91 | T1.E 37.31,67.06 33.12,71.25 | C8.- 45.71,78.78 JTAG.4 | 59.99,38.12 59.2,38.91 C14.- 56.2,37.72 C2.1 54.13,37.7 C7.1 51.45,37.7 50.75,37 50.75,35.25 51.62,34.38 52.62,34.38 53.08,33.92 53.12,33.92 IC.51
  Top 0.254: 59.99,38.12 C6.1 60.96,38.08 v62.23,39.35 | C4.1 47.66,44.95 C17.1 | C20.1 36.37,27.61 v36.25,27.5 | 35.62,36.88 35.62,33.38 v35.77,33.12 | LS1.7 LS1.6 | LS1.7 LS1.11 | LS1.13 44.52,55.15 v45,55.62 48.12,55.62 48.49,55.26 LS2.22 48.49,53.38 48.75,53.12 53.75,53.12 54.34,53.72 LS2.13 54.34,57.47 56.25,59.38 63.75,59.38 64.17,58.96 LS3.13 | IC.47 58.12,34.75 58.5,34.75 58.75,35 58.75,36.88 59.99,38.12 | LS2.12 54.34,48.72 55,49.38 59.38,49.38 59.62,49.13 LS3.5 | Q3.2 4.5,31.63 4,31.12 4,29.27 USER_BTN1.1 | Q4.2 4.61,34.27 4,34.88 4,36.48 Q5.2 4.75,37.01 v4.75,39.25 | TVS2.1 64.89,85.11 v65,85 | U3.PAD 15.81,62.34 U3.4 15.81,61.06 16.88,60 17.23,60 R14.2 | U4.4 16.27,75.61 16.88,75 17.14,75 R15.2 | 5V_LED.C 1.8V_LED.C 43.09,89.97 43.12,90 v41.25,90 | v11.25,93.12 11.25,90.25 TVS1.1 | C13.1 v70,37.7 71.32,37.7 LS5.4 | LS6.4 70.84,32.28 v70,32.5 | LS5.5 70.8,34.82 v70,34.38 | 64.38,46.25 64.4,46.27 C24.1 65.47,46.25 64.38,46.25 | LS2.11 LS2.7 | LS4.4 LS4.5 LS4.6 LS4.7 LS4.8 LS4.9 LS4.10 LS4.11 | LS4.11 73.87,48.37 73.88,48.38 74,48.38 74,50.38 v73.75,50.62 | v73.75,56.25 74,56 74,54.22 LS4.13 | v58.42,24.7 59.02,24.5 IC.25 | v66.25,30.2 62.06,30.2 IC.35
  Bottom 0.254: v46.12,26.12 v46.12,28.62 | v57.19,16.56 58.12,17.5 58.12,20 55.62,22.5 54.52,22.5 v54.45,22.57 53.75,23.12 53.75,24.5 52.88,25.38 v51.83,25.38 51.55,25.1 v51.55,21.73 | v63.75,19.38 63.75,18.75 v59.38,14.38 | v66.25,30.2 v66.25,25.62 | v45,15 41.7,18.3 v41.7,31.05 | TARGET_SW.3 36.33,73.2 38.07,74.94 | 38.07,74.94 39.38,76.25 | 39.38,76.25 41.88,78.75 45.73,78.75 JTAG.4 JTAG.20 65,79.81 v65,85 | v36.25,27.5 36.25,30.38 JP11.12 | v35.77,33.12 33.5,33.12 JP11.12 | JP11.5 31.64,51.65 31.25,51.25 31.25,35.38 JP11.12 | v45,55.62 45,70.62 39.38,76.25 | JP10.12 10.15,33.84 v4.75,39.25 | v41.25,90 22.5,90 18.75,93.75 11.88,93.75 v11.25,93.12 | v70,37.7 v70,34.38 v70,32.5 | v62.23,39.35 62.23,57.13 55.88,57.13 38.07,74.94 | v73.75,50.62 v73.75,56.25 | v73.12,26.25 70.62,26.25 v63.75,19.38 | v58.42,24.7 v63.75,19.38
  other vias: 32.88,68.12 37.25,46.25 73.5,41.88 66.25,33.83 73.75,19.5 36.75,84.62 53.34,46.34
  pour Bottom: 0,97.5 110,97.5 110,0 0,0
  pour Top: 0.62,96.88 109.38,96.88 109.38,0 0.62,0
I2C_SCL
  Top 0.254: JP13.14 86.54,28.79 JP12.14
I2C_SDA
  Top 0.254: JP13.13 86.54,31.32 JP12.13
JTAG_BUFFER_EN  (via drill 0.5)
  Top 0.254: v60.65,21.12 60.38,21 59.7,21 IC.21 | v38.75,56.25 38.75,54.28 LS1.22
  Bottom 0.254: v60.65,21.12 40.62,41.25 40.62,43.75 41.75,44.75 41.75,47 38.75,50 v38.75,56.25
JTAG_TCK
  Top 0.254: JP13.11 86.54,36.41 JP12.11 87.36,36.38 88.75,35 98.54,35 JTAG_SW.5
JTAG_TDI
  Top 0.254: JTAG_SW.6 98.75,37.75 89,37.75 87.83,38.92 JP12.10 86.54,38.95 JP13.10
JTAG_TDO
  Top 0.254: JTAG_SW.7 98.71,40.25 89,40.25 87.78,41.47 JP12.9 86.54,41.48 JP13.9
JTAG_TMS
  Top 0.254: JTAG_SW.8 98.67,42.75 88.5,42.75 87.25,44.01 JP12.8 78.58,44.01 JP13.8
N$1
  Top 0.254: LED_SW.6 5.08,31.04 Q3.1
N$2
  Top 0.254: IC.3 49.67,25.54 49.12,25 43.12,25 42.95,25.18 C22.1 41.55,24.73 X1.2
N$3
  Top 0.254: JP_PROTECTION.5 72.22,86.39 F2.P$1
N$4
  Top 0.254: JP_PROTECTION.3 72.36,88.92 F3.P$1
N$5
  Top 0.254: JP_PROTECTION.1 72.25,91.47 F4.P$1
N$6
  Top 0.254: F2.P$2 68.44,88.7 | 68.44,88.7 F3.P$2 68.54,91.41 F4.P$2 | 68.44,88.7 65,88.7 TVS2.2 64.89,91.36 Q2.3
N$7
  Top 0.254: X1.1 41.74,29.82 C21.1 42.92,28.32 43.8,27.43 46.02,27.43 47.98,25.48 48.85,25.48 IC.2
N$8  (via drill 0.5)
  Top 0.254: VC.3 62.9,9.4 C15.2 62.9,12.72 v61.88,13.75 | v53.75,11.88 53.75,10.62 54.17,10.21 CONN1.VUSB
  Bottom 0.254: v61.88,13.75 60.62,13.75 59.38,12.5 54.38,12.5 v53.75,11.88
N$9
  Top 0.254: R9.2 57.13,19.12 55.62,20.62 54.75,20.62 54.12,20 53.88,20 53.12,20.75 53.12,21.27 IC.14
N$10
  Top 0.254: R8.2 48.89,22.68 IC.6
N$11
  Top 0.254: R17.1 45.3,87.53 3.3V_LED.A
N$12
  Top 0.254: T1.B 40.41,63.63 R5.1 41.98,65.73 R6.2
N$13
  Top 0.254: PWR_LED.A 68.82,2.88 R7.1
N$14
  Top 0.254: R2.1 TARGET_PRESENT.A
N$15
  Top 0.254: F1.P$2 14.16,89.38 TVS1.2 15.76,90.11 Q1.3
N$16
  Top 0.254: R16.1 45.2,90.03 5V_LED.A
N$17
  Top 0.254: RX.A 98.25,32.64 R4.1
N$18
  Top 0.254: TX.A R3.1
N$20
  Top 0.254: LED_SW.4 4.87,36.12 Q5.1
N$24
  Top 0.254: R18.1 45.28,85.03 1.8V_LED.A
N$27
  Top 0.254: JP11.6 24.61,49.1 JP10.6
N$28
  Top 0.254: JP11.7 24.61,46.56 JP10.7
N$29
  Top 0.254: JP11.8 24.61,44.02 JP10.8
N$30
  Top 0.254: JP11.9 24.61,41.48 JP10.9
N$31
  Top 0.254: JP11.10 24.61,38.95 JP10.10
N$32
  Top 0.254: JP11.11 24.61,36.41 JP10.11
N$37
  Top 0.254: JP11.16 24.61,23.7 JP10.16
N$38
  Top 0.254: JP11.17 24.61,21.16 JP10.17
N$42
  Top 0.254: JP11.21 24.61,11.01 JP10.21
N$43
  Top 0.254: JP11.22 24.61,8.46 JP10.22
N$44
  Top 0.254: JP11.23 24.61,5.92 JP10.23
N$51
  Top 0.254: C25.1 16.48,65.86 15.81,65.19 U3.7
N$56
  Top 0.254: JP13.5 86.54,51.65 JP12.5
N$57
  Top 0.254: JP12.6 78.58,49.09 JP13.6
N$58
  Top 0.254: JP12.7 78.58,46.55 JP13.7
N$59
  Top 0.254: Q3.3 3.37,32.11 3.75,32.5 10,32.5 10.62,33.12 10.62,41 R21.1
N$60
  Top 0.254: 12.68,41.45 R21.2 10.71,43.13 USER_LED3.C
N$61
  Top 0.254: R22.2 12.71,48.35 USER_LED2.C
N$62
  Top 0.254: USER_LED1.C 12.79,50.97 R23.2
N$63
  Top 0.254: Q4.3 2.48,33.77 1.25,35 1.25,45 1.88,45.62 10.53,45.62 R22.1
N$66
  Top 0.254: UART1_SW.8 95.01,26.24 93.75,27.5 87.83,27.5 JP12.15
  Bottom 0.254: JP13.15 86.54,26.25 JP12.15
N$67
  Top 0.254: UART1_SW.7 95.05,23.7 93.75,25 87.88,25 JP12.16
  Bottom 0.254: JP13.16 86.54,23.7 JP12.16
N$68
  Top 0.254: UART1_SW.6 95.09,21.16 93.75,22.5 87.92,22.5 JP12.17
  Bottom 0.254: JP13.17 86.54,21.16 JP12.17
N$69
  Top 0.254: UART1_SW.5 95.13,18.62 93.75,20 87.95,20 JP12.18 86.54,18.62 JP13.18
N$70
  Top 0.254: JP13.19 86.54,16.09 JP12.19
N$73
  Top 0.254: U3.3 15.31,60.02 | 15.31,60.02 R14.1 | R19.2 14.07,58.78 15.31,60.02
N$74  (via drill 0.5)
  Top 0.254: Q5.3 3.34,43.97 v3.75,44.38 | v3.75,46.88 3.75,50 5,51.25 10.48,51.25 R23.1
  Bottom 0.254: v3.75,44.38 v3.75,46.88
N$78
  Top 0.254: U4.7 16.27,79.39 16.88,80 19.21,80 C26.1
N$79
  Top 0.254: LED_SW.5 5,33.58 Q4.1
N$80
  Top 0.254: R15.1 15.77,74.47 U4.3 15.77,74.69 R20.2
RTCK  (via drill 0.5)
  Top 0.254: v64.25,21.38 62.62,23 59.82,23 IC.24 | v51.25,44.38 51.25,45.75 49.75,47.25 49.75,48.32 LS2.5
  Bottom 0.254: v64.25,21.38 59.38,26.25 59.38,36.25 v51.25,44.38
RTCK-1  (via drill 0.5)
  Top 0.254: LS2.19 50.45,57.95 v56.88,64.38
  Bottom 0.254: v56.88,64.38 56.88,74.44 JTAG.11
SK  (via drill 0.5)
  Top 0.254: IC.62 46.25,33.03 46.25,33.75 43.73,36.27 MEM.2 41.27,36.27 40,35 40,34.16 R11.1 38.88,33 v40.25,33
  Bottom 0.254: PROG.4 44.99,6.26 39.38,11.88 39.38,32.12 v40.25,33
SPI_SCK
  Top 0.254: JP13.3 86.54,56.73 JP12.3
SPI_SDI
  Top 0.254: JP13.1 86.54,61.8 JP12.1
SPI_SDO
  Top 0.254: JP12.2 78.58,59.24 JP13.2
TARGET_PRESENT  (via drill 0.5)
  Top 0.254: v61.88,20 62.38,20.5 62.38,20.88 61.25,22 59.38,22 59.38,22.03 IC.22 | v36.25,59.38 36.44,59.56 T1.C 37.31,61.44 36.25,62.5 36.25,66.25 29.9,72.6 R1.1 | TARGET_PRESENT.C R1.1 | R1.1
  Bottom 0.254: v61.88,20 57.5,15.62 48.75,15.62 48.12,16.25 48.12,28.12 35.62,40.62 35.62,58.75 v36.25,59.38
TCK-1  (via drill 0.5)
  Top 0.254: LS1.19 40.62,55.12 41.75,56.25 41.75,58 54.38,70.62 54.38,74.48 JTAG.9 | JTAG_SW.4 89.61,36.48 v89.38,36.25
  Bottom 0.254: v89.38,36.25 88,37.62 83.62,37.62 83.12,38.12 83.12,42.38 80.25,45.25 76.62,45.25 69.38,52.5 69.38,56.88 68.12,58.12 61.25,58.12 55.62,63.75 55.62,73.94 JTAG.9
TCK/SK/TXD  (via drill 0.5)
  Top 0.254: IC.16 54.26,21.01 54.62,21.38 v55.48,21.45 | v37.5,43.12 40,43.12 41,44.12 41,44.75 40,45.75 40,48.34 LS1.5
  Bottom 0.254: v55.48,21.45 55.12,21.38 51.25,17.5 49.38,17.5 49.38,28.12 37.5,40 v37.5,43.12
TDI-1  (via drill 0.5)
  Top 0.254: JTAG.5 49.65,68.4 40,58.75 40,56.25 39.38,55.62 39.38,54.25 LS1.21 | JTAG_SW.3 89.65,39.02 v89.38,38.75 | v58.12,68.75 55,68.75 v54.38,68.12
  Bottom 0.254: v89.38,38.75 89.25,38.75 87.88,40.12 84.88,40.12 84.38,40.62 84.38,43.12 80.62,46.88 80.62,64.38 76.88,68.12 58.75,68.12 v58.12,68.75 | v54.38,68.12 50.27,68.12 49.65,68.75 JTAG.5
TDI/DO/RXD  (via drill 0.5)
  Top 0.254: v38.75,44.38 38.75,48.29 LS1.3 | IC.17 56.86,20.99 56.25,21.65 56.25,22.57 v55,23.77
  Bottom 0.254: v55,23.77 55,24.25 38.75,40.38 v38.75,44.38
TDO/DI  (via drill 0.5)
  Top 0.254: v54.75,29.62 56.83,27.55 56.77,27.5 56.77,21.8 IC.18 | v48.75,44.38 48.75,46.25 48.49,46.51 LS2.3
  Bottom 0.254: v54.75,29.62 48.75,35.62 v48.75,44.38
TDO/DI-1  (via drill 0.5)
  Top 0.254: LS2.21 49.15,64.15 59.81,74.81 JTAG.13 | JTAG_SW.2 89.69,41.56 v89.38,41.25
  Bottom 0.254: v89.38,41.25 89.38,43.75 87.88,45.25 84.12,45.25 82.5,46.88 82.5,64.38 77.5,69.38 65.27,69.38 JTAG.13
TMS-1  (via drill 0.5)
  Top 0.254: LS1.20 39.98,55.35 40.88,56.25 40.88,58.38 51.88,69.38 51.88,74.52 JTAG.7 | JTAG_SW.1 90.89,44.1 v89.38,45.62
  Bottom 0.254: v89.38,45.62 89.38,63.75 77.12,76 53.88,76 52.71,74.83 JTAG.7
TMS/CS  (via drill 0.5)
  Top 0.254: IC.19 57.59,21.66 v59.88,19.38 | v40,44.38 39.38,45 39.38,48.32 LS1.4
  Bottom 0.254: v59.88,19.38 59.88,20.25 39.62,40.62 39.62,44 v40,44.38
TRST  (via drill 0.5)
  Top 0.254: IC.26 60.08,24.17 60.75,23.5 63.38,23.5 v63.75,23.12 | LS3.3 58.31,46.69 v59.12,45.88
  Bottom 0.254: v59.12,45.88 59.12,40.25 63.12,36.25 63.12,23.75 v63.75,23.12
TRST1  (via drill 0.5)
  Top 0.254: LS3.21 58.97,55.84 59.38,56.25 59.38,56.88 v58.12,58.12
  Bottom 0.254: v58.12,58.12 55.62,58.12 46.88,66.88 46.88,74.6 JTAG.3
TRST_BUF_EN  (via drill 0.5)
  Top 0.254: 60.77,24.86 IC.28 60.75,24.88 60,25.62 60,25.75 v60.38,26.62 | v58.12,56.25 58.38,56 58.38,54.26 LS3.22
  Bottom 0.254: v60.38,26.62 60.38,37.12 56.88,40.62 56.88,55 v58.12,56.25
TSRST  (via drill 0.5)
  Top 0.254: v65.62,22.5 64.12,24 60.94,24 IC.27 | v68.12,44.38 68.12,48.36 LS4.3
  Bottom 0.254: v65.62,22.5 67.5,24.38 67.5,43.75 v68.12,44.38
TSRST1  (via drill 0.5)
  Top 0.254: IC.23 59.02,23.11 59.62,22.5 61.92,22.5 v62.52,21.9 | v50,43.12 50,46 49.12,46.88 49.12,48.35 LS2.4
  Bottom 0.254: v62.52,21.9 62.38,22 58.75,25.62 58.75,34.38 v50,43.12
TSRST1-1
  Top 0.254: LS2.20 49.8,58.55 61.88,70.62 | 61.88,70.62 61.88,74.36 JTAG.15 | LS4.21 68.78,55.03 69.38,55.62 69.38,63.12 61.88,70.62
TSRST_EN  (via drill 0.5)
  Top 0.254: IC.29 61.14,25.23 61.75,24.62 64.75,24.62 v65,24.38 | v68.12,56.25 68.12,54.21 LS4.22
  Bottom 0.254: v65,24.38 65,53.12 v68.12,56.25
UART1_RX  (via drill 0.5)
  Top 0.254: LS6.7 72.31,23.07 75.5,19.88 81.25,19.88 82.5,21.25 v82.5,27.38 | UART1_SW.1 v89.39,26.24 v89.38,26.25
  Bottom 0.254: v89.38,26.25 87.88,27.38 v82.5,27.38
UART1_TX  (via drill 0.5)
  Top 0.254: UART1_SW.2 89.42,23.7 v89.38,23.75 | v73.75,36.25 73.12,36.25 72.36,35.49 LS5.7
  Bottom 0.254: v89.38,23.75 88.97,24.05 87.75,24.98 76.38,24.98 75.62,25.62 75.62,34.38 v73.75,36.25
UART2_RX
  Top 0.254: JP13.20 86.54,13.54 JP12.20
UART2_TX
  Top 0.254: JP13.21 86.54,11.01 JP12.21
UART_CTS#  (via drill 0.5)
  Top 0.254: LS6.3 71.8,33.07 71.38,33.5 69.5,33.5 v68.75,32.75 | v68.75,35.62 65.12,35.62 61.75,32.25 60.57,32.25 IC.40
  Bottom 0.254: v68.75,32.75 v68.75,35.62
UART_RTS#
  Top 0.254: LS5.3 71.86,36.98 71.5,36.62 64.24,36.62 IC.41
UART_RX
  Top 0.254: IC.38 60.43,30.68 60.9,31.15 72.2,31.15 72.31,31.26 LS6.2
UART_RXLED  (via drill 0.5)
  Top 0.254: TX.C 88.26,29.86 88.12,30 v80.62,30 | v70.62,40.62 51.25,40.62 50,39.38 50,35 51.98,33.02 51.98,32.98 52.49,32.46 IC.54
  Bottom 0.254: v80.62,30 80.62,39.5 79.88,40.25 71,40.25 v70.62,40.62
UART_TX
  Top 0.254: LS5.2 72.36,36.74 71.62,36 70.5,36 66.12,31.62 60.67,31.62 60.06,31.06 IC.39
UART_TXLED  (via drill 0.5)
  Top 0.254: IC.55 52.14,32.11 49.38,34.88 49.38,40 51.25,41.88 v70.62,41.88 | RX.C 82.01,32.64 v81.88,32.5
  Bottom 0.254: v81.88,32.5 81.88,41.25 80.38,42.75 71.5,42.75 v70.62,41.88
USER_BTN1
  Top 0.254: JP11.18 24.61,18.62 | 24.61,18.62 JP10.18 | 24.61,18.62 16.65,18.62 USER_BTN1.4 USER_BTN1.3
USER_BTN2
  Top 0.254: JP11.19 24.61,16.09 JP10.19 19.02,16.06 USER_BTN2.4 USER_BTN2.3
USER_BTN3
  Top 0.254: JP11.20 24.61,13.54 JP10.20 14.53,3.47 USER_BTN3.4 USER_BTN3.3
USER_LED1
  Top 0.254: JP11.13 24.61,31.32 JP10.13 24.53,31.25 21.88,31.25 17,36.12 LED_SW.3
USER_LED2
  Top 0.254: JP11.14 24.61,28.79 | 24.61,28.79 JP10.14 | 24.61,28.79 21.84,28.79 17.05,33.58 | 17.05,33.58 16.88,33.75 | LED_SW.2 17.05,33.58
USER_LED3
  Top 0.254: JP11.15 24.61,26.25 | 24.61,26.25 JP10.15 | 24.61,26.25 20.87,26.25 LED_SW.1
V_CPU
  Top 0.254: TARGET_SW.1 32.78,79.72 30,82.5 27.5,82.5 25,80 25,62.2 JP10.1 24.61,61.8 JP11.1
V_EXT
  Top 0.254: JP_PROTECTION.7 63.66,83.84 62.5,85 62.5,90.75 | 62.5,90.75 Q2.2 | 62.5,90.75 59.91,90.75 JP7.3 JP8.3 JP6.3
V_OPT
  Top 0.254: USER_LED3.A 12.91,43.53 15,45.62 15,48.75 | 15,48.75 14.12,49.62 11.88,49.62 USER_LED2.A | USER_LED1.A 10.7,53.82 11.88,55 | 11.88,55 14.38,55 15,54.38 15,48.75 | C27.+ 14.31,65.22 U3.10 U3.9 U3.8 | C28.+ 14.77,79.86 U4.10 U4.9 U4.8 15.77,85.77 17.5,87.5 21,87.5 | C27.+ 14.76,66.01 21,72.25 21,87.5 | 21,87.5 21,87.82 Q1.2 | 11.88,55 10,55 6.25,58.75 6.25,65 6.88,65.62 13.13,65.62 C27.+ | 21,87.5 34.38,87.5 38.75,91.88 47.56,91.88 R16.2 51.25,91.88 JP7.1
V_TARGET
  Top 0.254: 44.38,66.02 44.38,65.62 37.38,58.62 LS1.24 LS1.23 38.02,53.23 38.75,52.5 47.5,52.5 | 44.38,66.02 44.38,74.64 JTAG.1 | JTAG.1 JTAG.2 | TARGET_SW.2 36.25,75.75 | 36.25,75.75 43.66,75.75 JTAG.1 | 47.5,52.5 57.5,52.5 | 57.5,52.5 66.88,52.5 | 66.88,52.5 67.48,53.11 LS4.23 LS4.24 | 47.5,52.5 47.84,52.84 LS2.23 LS2.24 | 57.5,52.5 57.66,52.66 LS3.23 LS3.24 | LS5.8 73.57,34.82 75.62,36.88 | 75.62,36.88 75.62,51.88 75,52.5 66.88,52.5 | LS6.8 72.82,29.69 75.62,32.5 75.62,36.88 | C8.+ 36.28,75.78 36.25,75.75 | R5.2 44.45,66.02 44.38,66.02
VEXT_IN
  Top 0.254: JP_PROTECTION.8 JP_PROTECTION.6 JP_PROTECTION.4 JP_PROTECTION.2 | JP_PROTECTION.8 88.97,73.25 VME_PWR.P$1 90.22,73.5 JP5.2 90.17,78.72 90.17,81.26 JP5.1 90.27,81.57 VA_IN.P$1 VA_OUT.P$1 | 78.74,83.8 JP_PROTECTION.8
VOPT_IN
  Top 0.254: VMO_PWR.P$1 10.28,87.63 F1.P$1
VOUT_1.8  (via drill 0.5)
  Top 0.254: U4.1 U4.2 | U4.1 13.69,76.02 C30.+ 12.33,77.16 R20.1 | 49.69,84.69 51.25,86.25 51.84,86.25 JP6.1 | 49.69,84.69 48.12,83.12 34.38,83.12 v32.5,85 | v14.38,75 14.38,75.62 U4.1 | R18.2 49.34,85.03 49.69,84.69
  Bottom 0.254: v32.5,85 22.5,75 v14.38,75
VOUT_3.3  (via drill 0.5)
  Top 0.254: R19.1 11.98,62.83 C29.+ 13.35,61.47 U3.1 | U3.2 U3.1 | R17.2 v51.25,87.53 51.84,88.12 JP8.1 | U3.1 14.31,61.19 v13.75,60.62
  Bottom 0.254: v13.75,60.62 20,60.62 28.75,69.38 28.75,79.38 35.62,86.25 50,86.25 50.62,86.91 v51.25,87.53
VPHY
  Top 0.254: IC.4 49.16,24.38 45.62,24.38 45.02,23.77 L2.1 44.45,22.84 44.45,21.57 C11.+ C12.2
  Top 0.813: 45.02,20.92 C11.+ | C12.2
VPLL  (via drill 0.5)
  Top 0.254: v50.75,18.62 50.74,18.12 50.94,17.93 L1.1 49.16,16.82 C10.2 47.66,16.76 C9.+ | v52.75,24.38 52.7,24.38 IC.9
  Top 0.813: C10.2 49.34,16.65
  Bottom 0.254: v52.75,24.38 52.75,20.25 v50.75,18.62

### Text on the board
tNames: V_BRD | 500 mA | 5V | 3.3V | 300 mA | 150 mA | 1.8V | V_OPT | V_EXT | V_OPT+ | NONE | I+ | V+ | 5V | VTG | GND... | ...GND | V_OPT- | I- | V- | VTG | TRST | TDI | TMS | TCK | RTCK | TDO | TSRST | NC | NC | V_CPU | SPI_DI | SPI_DO | 5V | 3.3V | SPI_CK | 1.8V | !SPI_SS | GND | TMS | TDO | TDI | TCK | GND | GND | P_UL1 | P_UL2 | P_UL3 | RX | TX | !RTS | P_UB1 | !CTS | P_UB2 | P_UB3 | UART2_RX | UART2_TX | !UART2_RTS | GND | 3.3V | DATA | SK | CS | !UART2_CTS | GND | USB | GND